# EAGLE design Enclosure 100x68 PBIA (EAGLE 9.6.1)
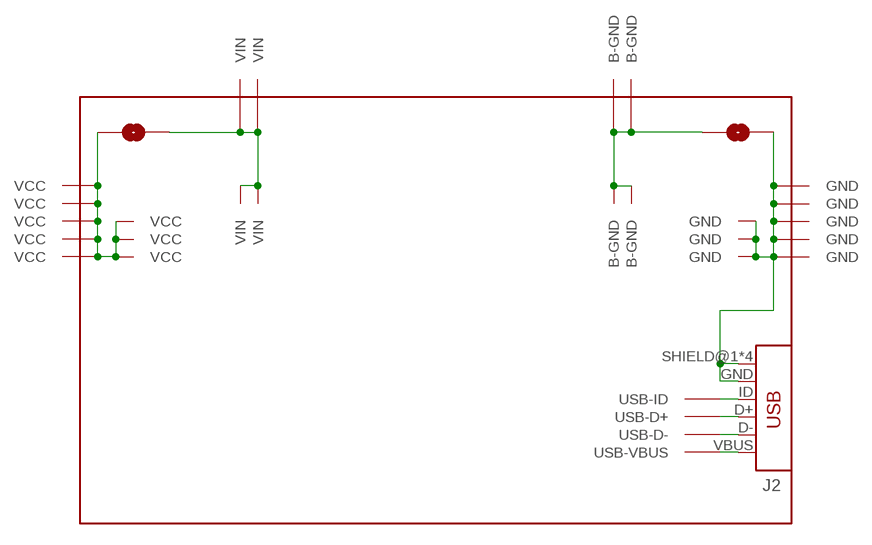
[diagram p0: schematic, sheet 1]

## Parts
J2  USB_MINI-B_SMT  [USB-MINIB]
P1  PROTO-34X22-BAT-PI-USB-SJ  [PROTO-34X22-BAT-PI-USB-SJ]

## Nets
GND: J2.GND J2.SHIELD@1(SHIELD) J2.SHIELD@2(SHIELD) J2.SHIELD@3(SHIELD) J2.SHIELD@4(SHIELD) P1.GND P1.P33-13(GND) P1.P33-14(GND) P1.P33-15(GND) P1.P34-13(GND) P1.P34-14(GND) P1.P34-15(GND) P1.P34-16(GND) P1.P34-17(GND)
N$2: P1.P02-17(VIN) P1.P03-16(VIN) P1.P05-19(VIN) P1.P06-19(VIN) P1.VIN
N$4: P1.B-GND P1.P28-19(B-GND) P1.P30-19(B-GND) P1.P32-16(B-GND) P1.P33-17(B-GND)
N$5: J2.ID P1.P31-09(USB-ID)
N$6: J2.D+ P1.P31-08(USB-D+)
N$7: J2.D- P1.P31-07(USB-D-)
N$8: J2.VBUS P1.P31-06(USB-VBUS)
VCC: P1.P01-13(VCC) P1.P01-14(VCC) P1.P01-15(VCC) P1.P01-16(VCC) P1.P01-17(VCC) P1.P02-13(VCC) P1.P02-14(VCC) P1.P02-15(VCC) P1.VCC

## Library data of the parts
J2 = digitalconcepts:USB_MINI-B: USB Mini-B Connector Breaks out 5 pins, and includes shield pins if needed.
P1 = digitalconcepts:PROTO-34X22-BAT-PI-USB-SJ: 34 x 22 Prototyping board, with battery connection (SJ isolation to GND + Vcc plane), Pi Zero stand off mounting holes and micro-USB connector to fit a 100 x 68 enclosure

## Board
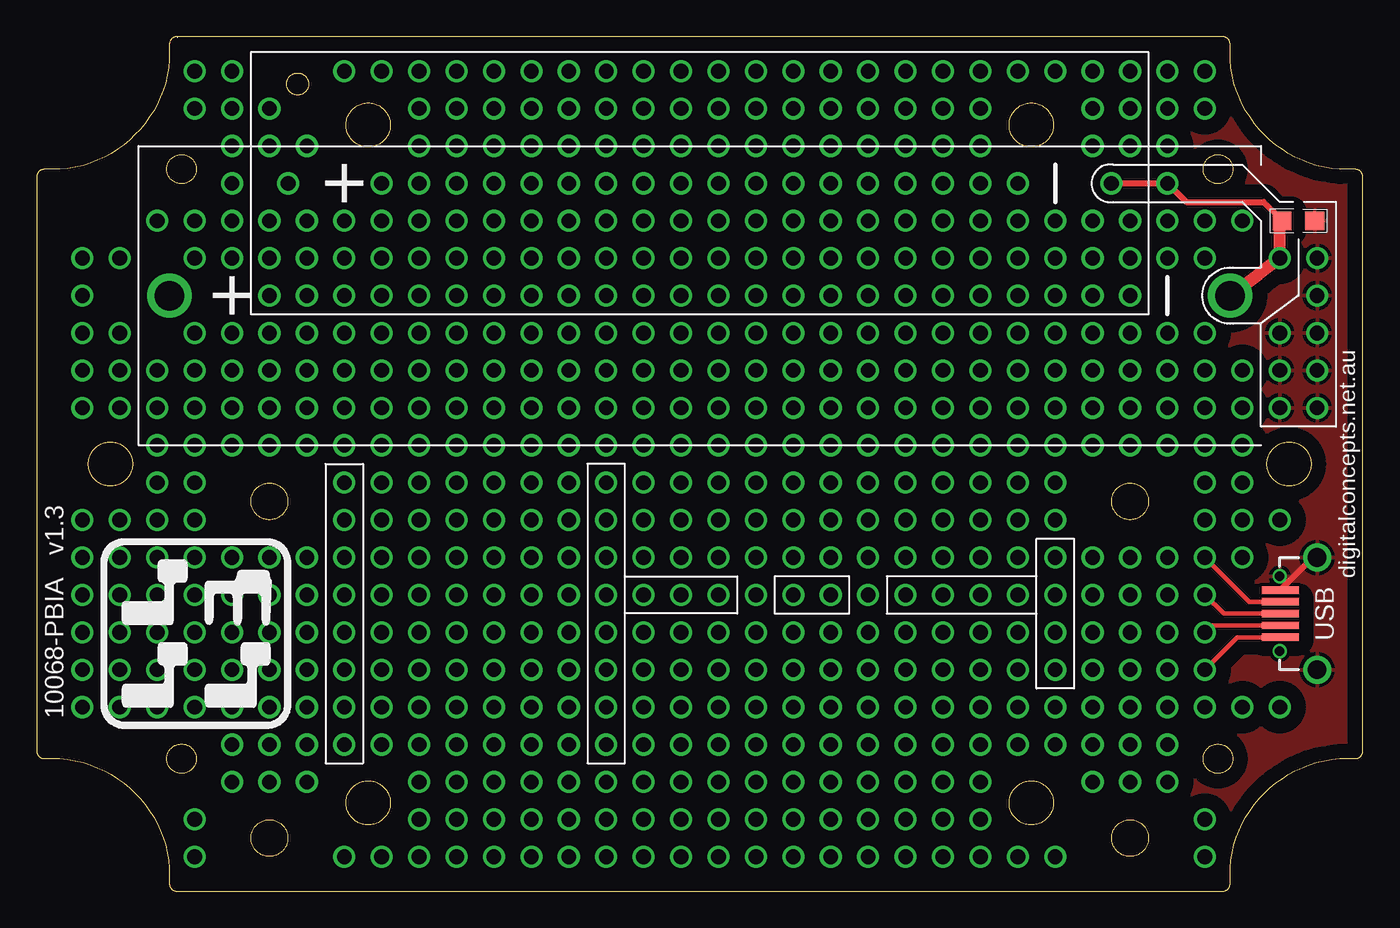
[diagram p1: board, top side]
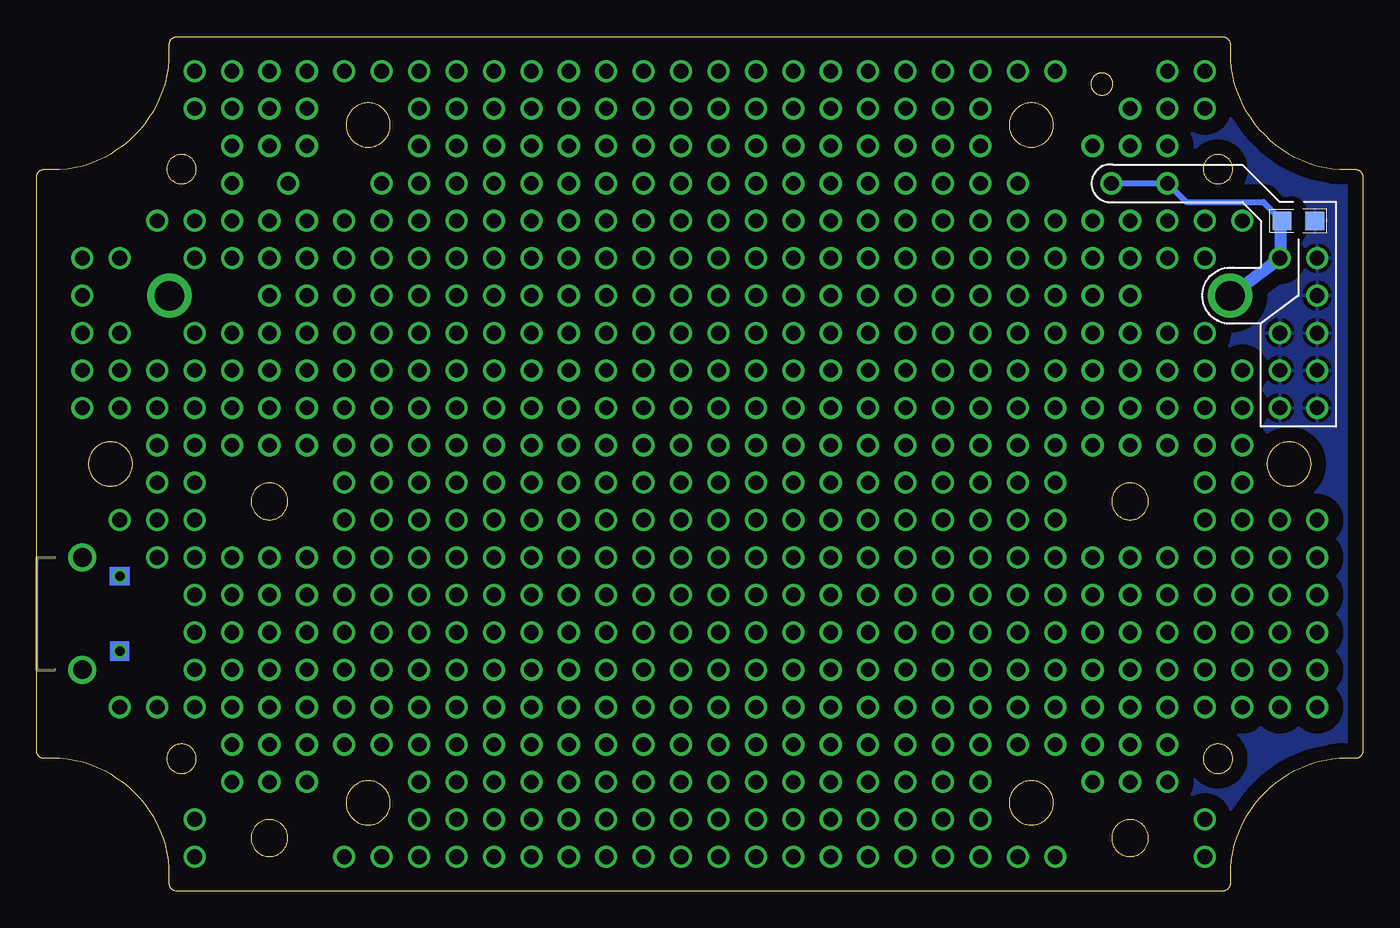
[diagram p2: board, bottom side, seen from below]

Size 90 x 58 mm. Coordinates in mm from the lower left corner, seen from the top.
Outline: 9.4,57.99 9.37,57.98 9.34,57.97 9.31,57.96 9.28,57.95 9.25,57.93 9.22,57.91 9.19,57.9 9.17,57.88 9.15,57.85 9.12,57.83 9.1,57.81 9.09,57.78 9.07,57.75 9.05,57.72 9.03,57.66 9.02,57.63 9.01,57.6 9,57.57 9,57.53 9,56.45 8.94,55.91 8.84,55.39 8.73,54.87 8.57,54.36 8.37,53.89 8.17,53.41 7.92,52.95 7.63,52.53 7.35,52.1 7.02,51.7 6.66,51.34 6.29,50.98 5.9,50.65 5.47,50.37 5.05,50.08 4.59,49.83 4.11,49.63 3.64,49.43 3.13,49.27 2.61,49.16 2.09,49.06 1.55,49 0.46,49 0.43,49 0.4,48.99 0.37,48.98 0.33,48.97 0.3,48.96 0.27,48.95 0.25,48.93 0.22,48.91 0.19,48.9 0.17,48.88 0.15,48.85 0.12,48.83 0.1,48.81 0.08,48.78 0.07,48.75 0.05,48.72 0.04,48.69 0.03,48.66 0.02,48.63 0.01,48.6 0,48.57 0,48.53 0,9.46 0,9.43 0.01,9.4 0.02,9.37 0.03,9.33 0.04,9.3 0.05,9.28 0.07,9.25 0.08,9.22 0.1,9.19 0.12,9.17 0.17,9.12 0.19,9.1 0.22,9.09 0.25,9.07 0.27,9.05 0.3,9.04 0.33,9.03 0.37,9.02 0.4,9.01 0.43,9 0.46,9 1.55,9 2.09,8.94 2.61,8.84 3.13,8.73 3.64,8.57 4.11,8.37 4.59,8.17 5.05,7.92 5.47,7.63 5.9,7.35 6.29,7.02 6.66,6.66 7.02,6.29 7.35,5.9 7.63,5.47 7.92,5.05 8.17,4.59 8.37,4.11 8.57,3.64 8.73,3.13 8.84,2.61 8.94,2.09 9,1.55 9,0.46 9,0.43 9.01,0.4 9.02,0.37 9.03,0.33 9.04,0.31 9.05,0.28 9.07,0.25 9.09,0.22 9.1,0.19 9.12,0.17 9.15,0.15 9.17,0.12 9.19,0.1 9.25,0.07 9.28,0.05 9.31,0.04 9.34,0.03 9.37,0.02 9.4,0.01 9.43,0 9.47,0 80.53,0 80.57,0 80.63,0.02 80.66,0.03 80.69,0.04 80.72,0.05 80.75,0.07 80.78,0.08 80.81,0.1 80.83,0.12 80.85,0.15 80.88,0.17 80.9,0.19 80.91,0.22 80.93,0.25 80.95,0.28 80.96,0.31 80.97,0.33 80.98,0.37 80.99,0.4 81,0.43 81,0.47 81,1.55 81.06,2.09 81.16,2.61 81.27,3.13 81.43,3.64 81.63,4.11 81.83,4.59 82.08,5.05 82.37,5.47 82.65,5.9 82.98,6.3 83.34,6.66 83.7,7.02 84.1,7.35 84.53,7.63 84.95,7.92 85.41,8.17 85.89,8.37 86.36,8.57 86.87,8.73 87.39,8.84 87.91,8.94 88.45,9 89.53,9 89.57,9 89.6,9.01 89.63,9.02 89.66,9.03 89.69,9.04 89.72,9.05 89.75,9.07 89.78,9.09 89.81,9.1 89.83,9.12 89.85,9.15 89.88,9.17 89.9,9.19 89.91,9.22 89.93,9.25 89.95,9.28 89.96,9.31 89.97,9.34 89.98,9.37 89.99,9.4 90,9.43 90,9.47 90,48.53 90,48.57 89.99,48.6 89.98,48.63 89.97,48.66 89.96,48.69 89.95,48.72 89.93,48.75 89.91,48.78 89.9,48.81 89.88,48.83 89.85,48.85 89.83,48.88 89.81,48.9 89.78,48.91 89.75,48.93 89.72,48.95 89.69,48.96 89.66,48.97 89.63,48.98 89.6,48.99 89.57,49 89.53,49 88.45,49 87.91,49.06 87.39,49.16 86.87,49.27 86.36,49.43 85.89,49.63 85.41,49.83 84.95,50.08 84.53,50.37 84.1,50.65 83.7,50.98 82.98,51.7 82.65,52.1 82.37,52.53 82.08,52.95 81.83,53.41 81.63,53.89 81.43,54.36 81.27,54.87 81.16,55.39 81.06,55.91 81,56.45 81,57.53 81,57.57 80.99,57.6 80.98,57.63 80.97,57.66 80.96,57.69 80.95,57.72 80.93,57.75 80.91,57.78 80.9,57.81 80.88,57.83 80.85,57.85 80.83,57.88 80.81,57.9 80.78,57.91 80.75,57.93 80.72,57.95 80.69,57.96 80.66,57.97 80.63,57.98 80.6,57.99 80.57,58 80.53,58 9.47,58 9.43,58 9.4,57.99
Outline: 15.54,2.37 15.46,2.39 15.38,2.42 15.3,2.45 15.23,2.48 15.16,2.52 15.09,2.56 15.02,2.61 14.96,2.66 14.91,2.72 14.85,2.77 14.8,2.83 14.75,2.9 14.71,2.97 14.67,3.04 14.64,3.11 14.61,3.19 14.58,3.27 14.56,3.35 14.55,3.43 14.54,3.51 14.54,3.69 14.55,3.77 14.56,3.85 14.58,3.93 14.61,4.01 14.64,4.09 14.67,4.16 14.71,4.23 14.75,4.3 14.8,4.36 14.85,4.43 14.91,4.48 14.96,4.54 15.02,4.59 15.09,4.64 15.16,4.68 15.23,4.72 15.3,4.75 15.38,4.78 15.46,4.81 15.54,4.82 15.62,4.84 15.7,4.85 15.88,4.85 15.96,4.84 16.04,4.82 16.12,4.81 16.2,4.78 16.28,4.75 16.35,4.72 16.42,4.68 16.49,4.64 16.55,4.59 16.62,4.54 16.67,4.48 16.73,4.43 16.78,4.36 16.83,4.3 16.87,4.23 16.91,4.16 16.94,4.09 16.97,4.01 17,3.93 17.01,3.85 17.03,3.77 17.04,3.69 17.04,3.51 17.03,3.43 17.01,3.35 17,3.27 16.97,3.19 16.94,3.11 16.91,3.04 16.87,2.97 16.83,2.9 16.78,2.83 16.73,2.77 16.67,2.72 16.62,2.66 16.55,2.61 16.49,2.56 16.42,2.52 16.35,2.48 16.28,2.45 16.2,2.42 16.12,2.39 16.04,2.37 15.96,2.36 15.88,2.35 15.7,2.35 15.62,2.36 15.54,2.37
Outline: 74.46,4.82 74.54,4.81 74.62,4.78 74.7,4.75 74.77,4.72 74.84,4.68 74.91,4.64 74.97,4.59 75.04,4.54 75.15,4.43 75.2,4.36 75.25,4.3 75.29,4.23 75.33,4.16 75.36,4.09 75.39,4.01 75.42,3.93 75.43,3.85 75.45,3.77 75.46,3.69 75.46,3.51 75.45,3.43 75.43,3.35 75.42,3.27 75.39,3.19 75.36,3.11 75.33,3.04 75.29,2.97 75.2,2.83 75.15,2.77 75.09,2.72 75.04,2.66 74.97,2.61 74.91,2.56 74.84,2.52 74.77,2.48 74.7,2.45 74.62,2.42 74.54,2.39 74.46,2.37 74.38,2.36 74.3,2.35 74.12,2.35 74.04,2.36 73.96,2.37 73.88,2.39 73.8,2.42 73.72,2.45 73.65,2.48 73.58,2.52 73.51,2.56 73.44,2.61 73.38,2.66 73.33,2.72 73.27,2.77 73.22,2.83 73.13,2.97 73.09,3.04 73.06,3.11 73.03,3.19 73,3.27 72.98,3.35 72.97,3.43 72.96,3.51 72.96,3.69 72.97,3.77 72.98,3.85 73,3.93 73.03,4.01 73.06,4.09 73.09,4.16 73.13,4.23 73.17,4.3 73.22,4.36 73.27,4.43 73.38,4.54 73.44,4.59 73.51,4.64 73.58,4.68 73.65,4.72 73.72,4.75 73.8,4.78 73.88,4.81 73.96,4.82 74.04,4.84 74.12,4.85 74.3,4.85 74.38,4.84 74.46,4.82
Outline: 67.81,7.46 67.9,7.44 68,7.41 68.09,7.37 68.18,7.33 68.26,7.28 68.34,7.23 68.42,7.18 68.5,7.12 68.56,7.05 68.63,6.98 68.69,6.91 68.75,6.83 68.8,6.75 68.85,6.66 68.89,6.57 68.92,6.48 68.95,6.39 68.97,6.29 68.99,6.19 69,6.09 69,5.88 68.99,5.78 68.97,5.69 68.95,5.59 68.92,5.49 68.89,5.4 68.85,5.31 68.8,5.23 68.75,5.15 68.69,5.07 68.63,4.99 68.56,4.93 68.5,4.86 68.42,4.8 68.34,4.74 68.26,4.69 68.18,4.64 68.09,4.61 68,4.57 67.9,4.54 67.81,4.52 67.71,4.5 67.61,4.49 67.4,4.49 67.3,4.5 67.2,4.52 67.1,4.54 67.01,4.57 66.92,4.61 66.83,4.64 66.74,4.69 66.59,4.8 66.51,4.86 66.44,4.93 66.37,4.99 66.31,5.07 66.26,5.15 66.21,5.23 66.16,5.31 66.12,5.4 66.08,5.49 66.05,5.59 66.03,5.69 66.01,5.78 66,5.88 66,6.09 66.01,6.19 66.05,6.39 66.08,6.48 66.12,6.57 66.16,6.66 66.21,6.75 66.26,6.83 66.31,6.91 66.37,6.98 66.44,7.05 66.51,7.12 66.59,7.18 66.67,7.23 66.74,7.28 66.83,7.33 66.92,7.37 67.01,7.41 67.1,7.44 67.2,7.46 67.3,7.48 67.4,7.49 67.61,7.49 67.71,7.48 67.81,7.46
Outline: 22.8,7.46 22.89,7.44 22.99,7.41 23.08,7.37 23.17,7.33 23.25,7.28 23.33,7.23 23.41,7.18 23.49,7.12 23.56,7.05 23.62,6.98 23.68,6.91 23.74,6.83 23.79,6.75 23.84,6.66 23.88,6.57 23.92,6.48 23.94,6.39 23.96,6.29 23.98,6.19 24,6.09 24,5.88 23.98,5.78 23.96,5.69 23.94,5.59 23.92,5.49 23.88,5.4 23.84,5.31 23.79,5.23 23.74,5.15 23.68,5.07 23.62,4.99 23.56,4.93 23.49,4.86 23.41,4.8 23.25,4.69 23.17,4.64 23.08,4.61 22.99,4.57 22.89,4.54 22.8,4.52 22.7,4.5 22.6,4.49 22.39,4.49 22.29,4.5 22.19,4.52 22.1,4.54 22,4.57 21.91,4.61 21.82,4.64 21.74,4.69 21.66,4.74 21.58,4.8 21.5,4.86 21.43,4.93 21.37,4.99 21.3,5.07 21.25,5.15 21.2,5.23 21.15,5.31 21.11,5.4 21.07,5.49 21.05,5.59 21.02,5.69 21.01,5.78 20.99,5.88 20.99,6.09 21.01,6.19 21.02,6.29 21.05,6.39 21.07,6.48 21.11,6.57 21.15,6.66 21.2,6.75 21.25,6.83 21.3,6.91 21.37,6.98 21.43,7.05 21.5,7.12 21.58,7.18 21.66,7.23 21.74,7.28 21.82,7.33 21.91,7.37 22,7.41 22.1,7.44 22.19,7.46 22.29,7.48 22.39,7.49 22.6,7.49 22.7,7.48 22.8,7.46
Outline: 80.38,9.96 80.44,9.95 80.51,9.93 80.57,9.91 80.63,9.88 80.68,9.85 80.74,9.81 80.79,9.78 80.84,9.74 80.89,9.69 80.93,9.65 80.97,9.6 81.01,9.54 81.04,9.49 81.07,9.43 81.1,9.37 81.13,9.31 81.14,9.25 81.16,9.19 81.17,9.12 81.18,9.05 81.18,8.92 81.17,8.85 81.16,8.78 81.14,8.72 81.13,8.66 81.1,8.6 81.07,8.54 81.04,8.48 81.01,8.43 80.97,8.37 80.93,8.32 80.89,8.28 80.84,8.23 80.79,8.19 80.74,8.16 80.68,8.12 80.63,8.09 80.57,8.06 80.51,8.04 80.44,8.02 80.38,8 80.31,7.99 80.25,7.98 80.11,7.98 80.04,7.99 79.98,8 79.91,8.02 79.85,8.04 79.79,8.06 79.73,8.09 79.67,8.12 79.62,8.16 79.57,8.19 79.52,8.23 79.47,8.28 79.43,8.32 79.38,8.37 79.35,8.43 79.31,8.48 79.28,8.54 79.26,8.6 79.23,8.66 79.21,8.72 79.2,8.78 79.19,8.85 79.18,8.92 79.18,9.05 79.19,9.12 79.2,9.19 79.21,9.25 79.23,9.31 79.26,9.37 79.28,9.43 79.31,9.49 79.35,9.54 79.38,9.6 79.43,9.65 79.47,9.69 79.52,9.74 79.57,9.78 79.62,9.81 79.67,9.85 79.73,9.88 79.79,9.91 79.85,9.93 79.91,9.95 79.98,9.96 80.04,9.98 80.11,9.98 80.25,9.98 80.31,9.98 80.38,9.96
Outline: 10.02,9.96 10.09,9.95 10.15,9.93 10.21,9.91 10.27,9.88 10.33,9.85 10.38,9.81 10.43,9.78 10.48,9.74 10.53,9.69 10.57,9.65 10.61,9.6 10.65,9.54 10.69,9.49 10.72,9.43 10.74,9.37 10.77,9.31 10.79,9.25 10.8,9.19 10.81,9.12 10.82,9.05 10.82,8.92 10.81,8.85 10.8,8.78 10.79,8.72 10.77,8.66 10.74,8.6 10.72,8.54 10.69,8.48 10.65,8.43 10.61,8.37 10.57,8.32 10.53,8.28 10.48,8.23 10.43,8.19 10.38,8.16 10.33,8.12 10.27,8.09 10.21,8.06 10.15,8.04 10.09,8.02 10.02,8 9.96,7.99 9.89,7.98 9.75,7.98 9.68,7.99 9.62,8 9.55,8.02 9.49,8.04 9.43,8.06 9.37,8.09 9.31,8.12 9.26,8.16 9.21,8.19 9.16,8.23 9.11,8.28 9.07,8.32 9.03,8.37 8.99,8.43 8.96,8.48 8.92,8.54 8.9,8.6 8.87,8.66 8.85,8.72 8.84,8.78 8.83,8.85 8.82,8.92 8.82,9.05 8.83,9.12 8.84,9.19 8.85,9.25 8.87,9.31 8.9,9.37 8.92,9.43 8.96,9.49 8.99,9.54 9.03,9.6 9.07,9.65 9.11,9.69 9.16,9.74 9.21,9.78 9.26,9.81 9.31,9.85 9.37,9.88 9.43,9.91 9.49,9.93 9.55,9.95 9.62,9.96 9.68,9.98 9.75,9.98 9.89,9.98 9.96,9.98 10.02,9.96
Outline: 15.54,25.23 15.46,25.25 15.38,25.28 15.3,25.31 15.23,25.34 15.16,25.38 15.09,25.42 15.02,25.47 14.96,25.52 14.91,25.58 14.85,25.63 14.8,25.69 14.75,25.76 14.71,25.83 14.67,25.9 14.61,26.05 14.58,26.13 14.56,26.21 14.55,26.29 14.54,26.37 14.54,26.55 14.55,26.63 14.56,26.71 14.58,26.79 14.61,26.87 14.64,26.95 14.67,27.02 14.71,27.09 14.75,27.16 14.8,27.22 14.85,27.29 14.96,27.4 15.02,27.45 15.09,27.5 15.16,27.54 15.23,27.58 15.3,27.61 15.38,27.64 15.46,27.67 15.54,27.68 15.62,27.7 15.7,27.71 15.88,27.71 15.96,27.7 16.04,27.68 16.12,27.67 16.2,27.64 16.28,27.61 16.35,27.58 16.42,27.54 16.49,27.5 16.55,27.45 16.62,27.4 16.73,27.29 16.78,27.22 16.83,27.16 16.87,27.09 16.91,27.02 16.94,26.95 16.97,26.87 17,26.79 17.01,26.71 17.03,26.63 17.04,26.55 17.04,26.37 17.03,26.29 17.01,26.21 17,26.13 16.97,26.05 16.94,25.97 16.91,25.9 16.87,25.83 16.83,25.76 16.78,25.69 16.73,25.63 16.67,25.58 16.62,25.52 16.55,25.47 16.49,25.42 16.42,25.38 16.35,25.34 16.28,25.31 16.2,25.28 16.12,25.25 16.04,25.23 15.96,25.22 15.88,25.21 15.7,25.21 15.62,25.22 15.54,25.23
Outline: 75.15,27.29 75.2,27.22 75.25,27.16 75.29,27.09 75.33,27.02 75.36,26.95 75.39,26.87 75.42,26.79 75.43,26.71 75.45,26.63 75.46,26.55 75.46,26.37 75.45,26.29 75.43,26.21 75.42,26.13 75.39,26.05 75.36,25.97 75.33,25.9 75.29,25.83 75.2,25.69 75.15,25.63 75.09,25.58 75.04,25.52 74.97,25.47 74.91,25.42 74.84,25.38 74.77,25.34 74.7,25.31 74.62,25.28 74.54,25.25 74.46,25.23 74.38,25.22 74.3,25.21 74.12,25.21 74.04,25.22 73.96,25.23 73.88,25.25 73.8,25.28 73.72,25.31 73.65,25.34 73.58,25.38 73.51,25.42 73.44,25.47 73.38,25.52 73.33,25.58 73.27,25.63 73.22,25.69 73.13,25.83 73.09,25.9 73.06,25.97 73.03,26.05 73,26.13 72.98,26.21 72.97,26.29 72.96,26.37 72.96,26.55 72.97,26.63 72.98,26.71 73,26.79 73.03,26.87 73.06,26.95 73.09,27.02 73.13,27.09 73.17,27.16 73.22,27.22 73.27,27.29 73.38,27.4 73.44,27.45 73.51,27.5 73.58,27.54 73.65,27.58 73.72,27.61 73.8,27.64 73.88,27.67 73.96,27.68 74.04,27.7 74.12,27.71 74.3,27.71 74.38,27.7 74.46,27.68 74.54,27.67 74.62,27.64 74.7,27.61 74.77,27.58 74.84,27.54 74.91,27.5 74.97,27.45 75.04,27.4 75.15,27.29
Outline: 85.31,30.47 85.4,30.45 85.5,30.42 85.59,30.38 85.68,30.34 85.76,30.3 85.84,30.24 85.92,30.19 86,30.13 86.06,30.06 86.13,29.99 86.19,29.92 86.25,29.84 86.3,29.76 86.35,29.67 86.39,29.58 86.42,29.49 86.45,29.4 86.47,29.3 86.49,29.2 86.5,29.1 86.5,28.9 86.49,28.8 86.47,28.7 86.45,28.6 86.42,28.51 86.39,28.42 86.35,28.33 86.3,28.24 86.25,28.16 86.19,28.08 86.13,28.01 86.06,27.94 86,27.87 85.92,27.81 85.84,27.76 85.76,27.7 85.68,27.66 85.59,27.62 85.5,27.58 85.4,27.55 85.31,27.53 85.21,27.51 85.11,27.5 84.9,27.5 84.8,27.51 84.7,27.53 84.6,27.55 84.51,27.58 84.42,27.62 84.33,27.66 84.25,27.7 84.17,27.76 84.09,27.81 84.01,27.87 83.94,27.94 83.88,28.01 83.81,28.08 83.76,28.16 83.71,28.24 83.66,28.33 83.62,28.42 83.58,28.51 83.55,28.6 83.54,28.7 83.52,28.8 83.5,28.9 83.5,29.1 83.52,29.2 83.54,29.3 83.55,29.4 83.58,29.49 83.62,29.58 83.66,29.67 83.71,29.76 83.76,29.84 83.81,29.92 83.88,29.99 83.94,30.06 84.01,30.13 84.09,30.19 84.17,30.24 84.25,30.3 84.33,30.34 84.42,30.38 84.51,30.42 84.6,30.45 84.7,30.47 84.8,30.49 84.9,30.5 85.11,30.5 85.21,30.49 85.31,30.47
Outline: 5.3,30.47 5.39,30.45 5.49,30.42 5.67,30.34 5.75,30.3 5.83,30.24 5.91,30.19 5.99,30.13 6.06,30.06 6.12,29.99 6.18,29.92 6.24,29.84 6.29,29.76 6.34,29.67 6.41,29.49 6.44,29.4 6.46,29.3 6.48,29.2 6.49,29.1 6.49,28.9 6.48,28.8 6.46,28.7 6.44,28.6 6.41,28.51 6.38,28.42 6.34,28.33 6.29,28.24 6.24,28.16 6.18,28.08 6.12,28.01 6.06,27.94 5.99,27.87 5.91,27.81 5.83,27.76 5.75,27.7 5.67,27.66 5.58,27.62 5.49,27.58 5.39,27.55 5.3,27.53 5.2,27.51 5.1,27.5 4.89,27.5 4.79,27.51 4.69,27.53 4.59,27.55 4.5,27.58 4.41,27.62 4.32,27.66 4.24,27.7 4.16,27.76 4.08,27.81 4,27.87 3.93,27.94 3.87,28.01 3.8,28.08 3.75,28.16 3.7,28.24 3.65,28.33 3.61,28.42 3.57,28.51 3.54,28.6 3.52,28.7 3.5,28.8 3.49,28.9 3.49,29.1 3.5,29.2 3.52,29.3 3.54,29.4 3.57,29.49 3.61,29.58 3.65,29.67 3.7,29.76 3.75,29.84 3.8,29.92 3.87,29.99 3.93,30.06 4,30.13 4.08,30.19 4.16,30.24 4.24,30.3 4.32,30.34 4.5,30.42 4.59,30.45 4.69,30.47 4.79,30.49 4.89,30.5 5.1,30.5 5.2,30.49 5.3,30.47
Outline: 80.38,49.99 80.44,49.98 80.51,49.96 80.57,49.94 80.63,49.91 80.68,49.88 80.74,49.84 80.79,49.81 80.84,49.77 80.93,49.68 80.97,49.63 81.01,49.57 81.04,49.52 81.07,49.46 81.1,49.4 81.13,49.34 81.14,49.28 81.16,49.22 81.17,49.15 81.18,49.08 81.18,48.95 81.17,48.88 81.16,48.81 81.14,48.75 81.13,48.69 81.1,48.63 81.07,48.57 81.04,48.51 81.01,48.46 80.97,48.4 80.93,48.35 80.84,48.26 80.79,48.22 80.74,48.19 80.68,48.15 80.63,48.12 80.57,48.09 80.51,48.07 80.44,48.05 80.38,48.03 80.31,48.02 80.25,48.01 80.11,48.01 80.04,48.02 79.98,48.03 79.91,48.05 79.85,48.07 79.79,48.09 79.73,48.12 79.67,48.15 79.62,48.19 79.57,48.22 79.52,48.26 79.43,48.35 79.38,48.4 79.35,48.46 79.31,48.51 79.28,48.57 79.26,48.63 79.23,48.69 79.21,48.75 79.2,48.81 79.19,48.88 79.18,48.95 79.18,49.08 79.19,49.15 79.2,49.22 79.21,49.28 79.23,49.34 79.26,49.4 79.28,49.46 79.31,49.52 79.35,49.57 79.38,49.63 79.43,49.68 79.52,49.77 79.57,49.81 79.62,49.84 79.67,49.88 79.73,49.91 79.79,49.94 79.85,49.96 79.91,49.98 79.98,49.99 80.04,50.01 80.11,50.01 80.25,50.01 80.31,50.01 80.38,49.99
Outline: 10.02,49.99 10.09,49.98 10.15,49.96 10.21,49.94 10.27,49.91 10.33,49.88 10.38,49.84 10.43,49.81 10.48,49.77 10.53,49.72 10.57,49.68 10.61,49.63 10.65,49.57 10.69,49.52 10.72,49.46 10.74,49.4 10.77,49.34 10.79,49.28 10.8,49.22 10.81,49.15 10.82,49.08 10.82,48.95 10.81,48.88 10.8,48.81 10.79,48.75 10.77,48.69 10.74,48.63 10.72,48.57 10.69,48.51 10.65,48.46 10.61,48.4 10.57,48.35 10.53,48.31 10.48,48.26 10.43,48.22 10.38,48.19 10.33,48.15 10.27,48.12 10.21,48.09 10.15,48.07 10.09,48.05 10.02,48.03 9.96,48.02 9.89,48.01 9.75,48.01 9.68,48.02 9.62,48.03 9.55,48.05 9.49,48.07 9.43,48.09 9.37,48.12 9.31,48.15 9.26,48.19 9.21,48.22 9.16,48.26 9.11,48.31 9.07,48.35 9.03,48.4 8.99,48.46 8.96,48.51 8.92,48.57 8.9,48.63 8.87,48.69 8.85,48.75 8.84,48.81 8.83,48.88 8.82,48.95 8.82,49.08 8.83,49.15 8.84,49.22 8.85,49.28 8.87,49.34 8.9,49.4 8.92,49.46 8.96,49.52 8.99,49.57 9.03,49.63 9.07,49.68 9.11,49.72 9.16,49.77 9.21,49.81 9.26,49.84 9.31,49.88 9.37,49.91 9.43,49.94 9.49,49.96 9.55,49.98 9.62,49.99 9.68,50.01 9.75,50.01 9.89,50.01 9.96,50.01 10.02,49.99
Outline: 22.19,50.54 22.1,50.56 22,50.59 21.91,50.63 21.82,50.67 21.74,50.71 21.66,50.77 21.58,50.82 21.5,50.88 21.43,50.95 21.37,51.02 21.31,51.09 21.25,51.17 21.2,51.25 21.15,51.34 21.11,51.43 21.07,51.52 21.05,51.61 21.03,51.71 21.01,51.81 21,51.91 21,52.12 21.01,52.22 21.03,52.31 21.05,52.41 21.07,52.51 21.11,52.6 21.15,52.69 21.2,52.77 21.25,52.85 21.31,52.93 21.37,53.01 21.43,53.07 21.5,53.14 21.58,53.2 21.66,53.26 21.74,53.31 21.82,53.36 21.91,53.39 22,53.43 22.1,53.46 22.19,53.48 22.29,53.5 22.39,53.51 22.6,53.51 22.7,53.5 22.8,53.48 22.89,53.46 22.99,53.43 23.08,53.39 23.17,53.36 23.25,53.31 23.33,53.26 23.41,53.2 23.49,53.14 23.56,53.07 23.62,53.01 23.68,52.93 23.74,52.85 23.79,52.77 23.84,52.69 23.88,52.6 23.91,52.51 23.94,52.41 23.96,52.31 23.98,52.22 24,52.12 24,51.91 23.98,51.81 23.96,51.71 23.94,51.61 23.91,51.52 23.88,51.43 23.84,51.34 23.79,51.25 23.74,51.17 23.68,51.09 23.62,51.02 23.56,50.95 23.49,50.88 23.41,50.82 23.33,50.77 23.25,50.71 23.17,50.67 23.08,50.63 22.99,50.59 22.89,50.56 22.8,50.54 22.7,50.52 22.6,50.51 22.39,50.51 22.29,50.52 22.19,50.54
Outline: 67.81,53.48 67.9,53.46 68,53.43 68.09,53.39 68.18,53.36 68.26,53.31 68.34,53.26 68.42,53.2 68.5,53.14 68.63,53.01 68.69,52.93 68.75,52.85 68.8,52.77 68.85,52.69 68.89,52.6 68.92,52.51 68.95,52.41 68.97,52.31 68.99,52.22 69,52.12 69,51.91 68.99,51.81 68.97,51.71 68.95,51.61 68.92,51.52 68.89,51.43 68.85,51.34 68.8,51.25 68.75,51.17 68.69,51.09 68.63,51.02 68.5,50.88 68.42,50.82 68.34,50.77 68.26,50.71 68.18,50.67 68.09,50.63 68,50.59 67.9,50.56 67.81,50.54 67.71,50.52 67.61,50.51 67.4,50.51 67.3,50.52 67.2,50.54 67.1,50.56 67.01,50.59 66.92,50.63 66.83,50.67 66.75,50.71 66.67,50.77 66.59,50.82 66.51,50.88 66.44,50.95 66.37,51.02 66.31,51.09 66.26,51.17 66.21,51.25 66.16,51.34 66.12,51.43 66.08,51.52 66.05,51.61 66.03,51.71 66.01,51.81 66,51.91 66,52.12 66.01,52.22 66.03,52.31 66.05,52.41 66.08,52.51 66.12,52.6 66.16,52.69 66.21,52.77 66.26,52.85 66.31,52.93 66.37,53.01 66.44,53.07 66.51,53.14 66.59,53.2 66.67,53.26 66.75,53.31 66.83,53.36 66.92,53.39 67.01,53.43 67.1,53.46 67.2,53.48 67.3,53.5 67.4,53.51 67.61,53.51 67.71,53.5 67.81,53.48
Outline: 17.85,55.53 17.9,55.52 17.95,55.5 17.99,55.48 18.04,55.46 18.08,55.44 18.12,55.41 18.16,55.39 18.2,55.36 18.23,55.32 18.27,55.29 18.3,55.25 18.32,55.21 18.35,55.17 18.37,55.13 18.39,55.08 18.41,55.04 18.43,54.99 18.44,54.94 18.45,54.89 18.45,54.84 18.45,54.74 18.45,54.69 18.44,54.64 18.43,54.59 18.41,54.55 18.39,54.5 18.37,54.46 18.35,54.41 18.32,54.37 18.3,54.33 18.27,54.3 18.23,54.26 18.2,54.23 18.16,54.2 18.12,54.17 18.08,54.14 18.04,54.12 17.99,54.1 17.95,54.08 17.9,54.07 17.85,54.06 17.8,54.05 17.75,54.04 17.65,54.04 17.6,54.05 17.55,54.06 17.5,54.07 17.45,54.08 17.41,54.1 17.37,54.12 17.32,54.14 17.28,54.17 17.24,54.2 17.21,54.23 17.17,54.26 17.14,54.3 17.11,54.33 17.08,54.37 17.05,54.41 17.03,54.46 17.01,54.5 16.99,54.55 16.98,54.59 16.97,54.64 16.96,54.69 16.95,54.74 16.95,54.84 16.96,54.89 16.97,54.94 16.98,54.99 16.99,55.04 17.01,55.08 17.03,55.13 17.05,55.17 17.08,55.21 17.11,55.25 17.14,55.29 17.17,55.32 17.21,55.36 17.24,55.39 17.28,55.41 17.32,55.44 17.37,55.46 17.41,55.48 17.45,55.5 17.5,55.52 17.55,55.53 17.6,55.54 17.65,55.54 17.75,55.54 17.8,55.54 17.85,55.53
Copper layers (1*16): Top 0.035mm / dielectric 1.5mm / Bottom 0.035mm
Design rules "default *": minimum track width 6mil, minimum drill 0.35mm, track to track 6mil, track to pad 6mil, pad to pad 6mil, via to via 6mil, smd to smd 6mil, copper to edge 40mil, drill to drill 6mil, minimum pad ring 0mil, minimum via ring 8mil, stop-mask expansion 4mil, vias tented up to drill 0mil, thermal gap 10mil

### Footprints (pad centres in the part's own frame; a part is rotated, then mirrored left to right if it is on the bottom)
USB-MINIB = smd 2.5 x 0.5: D+ 2.5,0; D- 2.5,0.8; GND 2.5,-1.6; ID 2.5,-0.8; VBUS 2.5,1.6 | drill 1.27: SHIELD@1 0,3.81; SHIELD@2 0,-3.81 | drill 0.65 pad 0.762: SHIELD@3 2.54,2.54; SHIELD@4 2.54,-2.54
PROTO-34X22-BAT-PI-USB-SJ = smd 1.27 x 1.27: B-GND 39.534,16.51; GND 41.746,16.51 | drill 1: P01-05 -41.91,-16.51; P01-06 -41.91,-13.97; P01-07 -41.91,-11.43; P01-08 -41.91,-8.89; P01-09 -41.91,-6.35; P01-10 -41.91,-3.81; P01-13 -41.91,3.81; P01-14 -41.91,6.35; P01-15 -41.91,8.89; P01-16 -41.91,11.43; P01-17 -41.91,13.97; P02-05 -39.37,-16.51; P02-06 -39.37,-13.97; P02-07 -39.37,-11.43; P02-08 -39.37,-8.89; P02-09 -39.37,-6.35; P02-10 -39.37,-3.81; P02-13 -39.37,3.81; P02-14 -39.37,6.35; P02-15 -39.37,8.89; P02-17 -39.37,13.97; P03-05 -36.83,-16.51; P03-06 -36.83,-13.97; P03-07 -36.83,-11.43; P03-08 -36.83,-8.89; P03-09 -36.83,-6.35; P03-10 -36.83,-3.81; P03-11 -36.83,-1.27; P03-12 -36.83,1.27; P03-13 -36.83,3.81; P03-14 -36.83,6.35; P03-18 -36.83,16.51; P04-01 -34.29,-26.67; P04-02 -34.29,-24.13; P04-05 -34.29,-16.51; P04-06 -34.29,-13.97; P04-07 -34.29,-11.43; P04-08 -34.29,-8.89; P04-09 -34.29,-6.35; P04-10 -34.29,-3.81; P04-11 -34.29,-1.27; P04-12 -34.29,1.27; P04-13 -34.29,3.81; P04-14 -34.29,6.35; P04-15 -34.29,8.89; P04-17 -34.29,13.97; P04-18 -34.29,16.51; P04-21 -34.29,24.13; P04-22 -34.29,26.67; P05-03 -31.75,-21.59; P05-04 -31.75,-19.05; P05-05 -31.75,-16.51; P05-06 -31.75,-13.97; P05-07 -31.75,-11.43; P05-08 -31.75,-8.89; P05-09 -31.75,-6.35; P05-12 -31.75,1.27; P05-13 -31.75,3.81; P05-14 -31.75,6.35; P05-15 -31.75,8.89; P05-17 -31.75,13.97; P05-18 -31.75,16.51; P05-19 -31.75,19.05; P05-20 -31.75,21.59; P05-21 -31.75,24.13; P05-22 -31.75,26.67; P06-03 -29.21,-21.59; P06-04 -29.21,-19.05; P06-05 -29.21,-16.51; P06-06 -29.21,-13.97; P06-07 -29.21,-11.43; P06-08 -29.21,-8.89; P06-09 -29.21,-6.35; P06-12 -29.21,1.27; P06-13 -29.21,3.81; P06-14 -29.21,6.35; P06-15 -29.21,8.89; P06-16 -29.21,11.43; P06-17 -29.21,13.97; P06-18 -29.21,16.51; P06-19 -27.94,19.05; P06-20 -29.21,21.59; P06-21 -29.21,24.13; P07-03 -26.67,-21.59; P07-04 -26.67,-19.05; P07-05 -26.67,-16.51; P07-06 -26.67,-13.97; P07-07 -26.67,-11.43; P07-08 -26.67,-8.89; P07-09 -26.67,-6.35; P07-12 -26.67,1.27; P07-13 -26.67,3.81; P07-14 -26.67,6.35; P07-15 -26.67,8.89; P07-16 -26.67,11.43; P07-17 -26.67,13.97; P07-18 -26.67,16.51; P07-20 -26.67,21.59; P08-01 -24.13,-26.67; P08-04 -24.13,-19.05; P08-05 -24.13,-16.51; P08-06 -24.13,-13.97; P08-07 -24.13,-11.43; P08-08 -24.13,-8.89; P08-09 -24.13,-6.35; P08-10 -24.13,-3.81; P08-11 -24.13,-1.27; P08-12 -24.13,1.27; P08-13 -24.13,3.81; P08-14 -24.13,6.35; P08-15 -24.13,8.89; P08-16 -24.13,11.43; P08-17 -24.13,13.97; P08-18 -24.13,16.51; P08-22 -24.13,26.67; P09-01 -21.59,-26.67; P09-04 -21.59,-19.05; P09-05 -21.59,-16.51; P09-06 -21.59,-13.97; P09-07 -21.59,-11.43; P09-08 -21.59,-8.89; P09-09 -21.59,-6.35; P09-10 -21.59,-3.81; P09-11 -21.59,-1.27; P09-12 -21.59,1.27; P09-13 -21.59,3.81; P09-14 -21.59,6.35; P09-15 -21.59,8.89; P09-16 -21.59,11.43; P09-17 -21.59,13.97; P09-18 -21.59,16.51; P09-19 -21.59,19.05; P09-22 -21.59,26.67; P10-01 -19.05,-26.67; P10-02 -19.05,-24.13; P10-03 -19.05,-21.59; P10-04 -19.05,-19.05; P10-05 -19.05,-16.51; P10-06 -19.05,-13.97; P10-07 -19.05,-11.43; P10-08 -19.05,-8.89; P10-09 -19.05,-6.35; P10-10 -19.05,-3.81; P10-11 -19.05,-1.27; P10-12 -19.05,1.27; P10-13 -19.05,3.81; P10-14 -19.05,6.35; P10-15 -19.05,8.89; P10-16 -19.05,11.43; P10-17 -19.05,13.97; P10-18 -19.05,16.51; P10-19 -19.05,19.05; P10-20 -19.05,21.59; P10-21 -19.05,24.13; P10-22 -19.05,26.67; P11-01 -16.51,-26.67; P11-02 -16.51,-24.13; P11-03 -16.51,-21.59; P11-04 -16.51,-19.05; P11-05 -16.51,-16.51; P11-06 -16.51,-13.97; P11-07 -16.51,-11.43; P11-08 -16.51,-8.89; P11-09 -16.51,-6.35; P11-10 -16.51,-3.81; P11-11 -16.51,-1.27; P11-12 -16.51,1.27; P11-13 -16.51,3.81; P11-14 -16.51,6.35; P11-15 -16.51,8.89; P11-16 -16.51,11.43; P11-17 -16.51,13.97; P11-18 -16.51,16.51; P11-19 -16.51,19.05; P11-20 -16.51,21.59; P11-21 -16.51,24.13; P11-22 -16.51,26.67; P12-01 -13.97,-26.67; P12-02 -13.97,-24.13; P12-03 -13.97,-21.59; P12-04 -13.97,-19.05; P12-05 -13.97,-16.51; P12-06 -13.97,-13.97; P12-07 -13.97,-11.43; P12-08 -13.97,-8.89; P12-09 -13.97,-6.35; P12-10 -13.97,-3.81; P12-11 -13.97,-1.27; P12-12 -13.97,1.27; P12-13 -13.97,3.81; P12-14 -13.97,6.35; P12-15 -13.97,8.89; P12-16 -13.97,11.43; P12-17 -13.97,13.97; P12-18 -13.97,16.51; P12-19 -13.97,19.05; P12-20 -13.97,21.59; P12-21 -13.97,24.13; P12-22 -13.97,26.67; P13-01 -11.43,-26.67; P13-02 -11.43,-24.13; P13-03 -11.43,-21.59; P13-04 -11.43,-19.05; P13-05 -11.43,-16.51; P13-06 -11.43,-13.97; P13-07 -11.43,-11.43; P13-08 -11.43,-8.89; P13-09 -11.43,-6.35; P13-10 -11.43,-3.81; P13-11 -11.43,-1.27; P13-12 -11.43,1.27; P13-13 -11.43,3.81; P13-14 -11.43,6.35; P13-15 -11.43,8.89; P13-16 -11.43,11.43; P13-17 -11.43,13.97; P13-18 -11.43,16.51; P13-19 -11.43,19.05; P13-20 -11.43,21.59; P13-21 -11.43,24.13; P13-22 -11.43,26.67; P14-01 -8.89,-26.67; P14-02 -8.89,-24.13; P14-03 -8.89,-21.59; P14-04 -8.89,-19.05; P14-05 -8.89,-16.51; P14-06 -8.89,-13.97; P14-07 -8.89,-11.43; P14-08 -8.89,-8.89; P14-09 -8.89,-6.35; P14-10 -8.89,-3.81; P14-11 -8.89,-1.27; P14-12 -8.89,1.27; P14-13 -8.89,3.81; P14-14 -8.89,6.35; P14-15 -8.89,8.89; P14-16 -8.89,11.43; P14-17 -8.89,13.97; P14-18 -8.89,16.51; P14-19 -8.89,19.05; P14-20 -8.89,21.59; P14-21 -8.89,24.13; P14-22 -8.89,26.67; P15-01 -6.35,-26.67; P15-02 -6.35,-24.13; P15-03 -6.35,-21.59; P15-04 -6.35,-19.05; P15-05 -6.35,-16.51; P15-06 -6.35,-13.97; P15-07 -6.35,-11.43; P15-08 -6.35,-8.89; P15-09 -6.35,-6.35; P15-10 -6.35,-3.81; P15-11 -6.35,-1.27; P15-12 -6.35,1.27; P15-13 -6.35,3.81; P15-14 -6.35,6.35; P15-15 -6.35,8.89; P15-16 -6.35,11.43; P15-17 -6.35,13.97; P15-18 -6.35,16.51; P15-19 -6.35,19.05; P15-20 -6.35,21.59; P15-21 -6.35,24.13; P15-22 -6.35,26.67; P16-01 -3.81,-26.67; P16-02 -3.81,-24.13; P16-03 -3.81,-21.59; P16-04 -3.81,-19.05; P16-05 -3.81,-16.51; P16-06 -3.81,-13.97; P16-07 -3.81,-11.43; P16-08 -3.81,-8.89; P16-09 -3.81,-6.35; P16-10 -3.81,-3.81; P16-11 -3.81,-1.27; P16-12 -3.81,1.27; P16-13 -3.81,3.81; P16-14 -3.81,6.35; P16-15 -3.81,8.89; P16-16 -3.81,11.43; P16-17 -3.81,13.97; P16-18 -3.81,16.51; P16-19 -3.81,19.05; P16-20 -3.81,21.59; P16-21 -3.81,24.13; P16-22 -3.81,26.67; P17-01 -1.27,-26.67; P17-02 -1.27,-24.13; P17-03 -1.27,-21.59; P17-04 -1.27,-19.05; P17-05 -1.27,-16.51; P17-06 -1.27,-13.97; P17-07 -1.27,-11.43; P17-08 -1.27,-8.89; P17-09 -1.27,-6.35; P17-10 -1.27,-3.81; P17-11 -1.27,-1.27; P17-12 -1.27,1.27; P17-13 -1.27,3.81; P17-14 -1.27,6.35; P17-15 -1.27,8.89; P17-16 -1.27,11.43; P17-17 -1.27,13.97; P17-18 -1.27,16.51; P17-19 -1.27,19.05; P17-20 -1.27,21.59; P17-21 -1.27,24.13; P17-22 -1.27,26.67; P18-01 1.27,-26.67; P18-02 1.27,-24.13; P18-03 1.27,-21.59; P18-04 1.27,-19.05; P18-05 1.27,-16.51; P18-06 1.27,-13.97; P18-07 1.27,-11.43; P18-08 1.27,-8.89; P18-09 1.27,-6.35; P18-10 1.27,-3.81; P18-11 1.27,-1.27; P18-12 1.27,1.27; P18-13 1.27,3.81; P18-14 1.27,6.35; P18-15 1.27,8.89; P18-16 1.27,11.43; P18-17 1.27,13.97; P18-18 1.27,16.51; P18-19 1.27,19.05; P18-20 1.27,21.59; P18-21 1.27,24.13; P18-22 1.27,26.67; P19-01 3.81,-26.67; P19-02 3.81,-24.13; P19-03 3.81,-21.59; P19-04 3.81,-19.05; P19-05 3.81,-16.51; P19-06 3.81,-13.97; P19-07 3.81,-11.43; P19-08 3.81,-8.89; P19-09 3.81,-6.35; P19-10 3.81,-3.81; P19-11 3.81,-1.27; P19-12 3.81,1.27; P19-13 3.81,3.81; P19-14 3.81,6.35; P19-15 3.81,8.89; P19-16 3.81,11.43; P19-17 3.81,13.97; P19-18 3.81,16.51; P19-19 3.81,19.05; P19-20 3.81,21.59; P19-21 3.81,24.13; P19-22 3.81,26.67; P20-01 6.35,-26.67; P20-02 6.35,-24.13; P20-03 6.35,-21.59; P20-04 6.35,-19.05; P20-05 6.35,-16.51; P20-06 6.35,-13.97; P20-07 6.35,-11.43; P20-08 6.35,-8.89; P20-09 6.35,-6.35; P20-10 6.35,-3.81; P20-11 6.35,-1.27; P20-12 6.35,1.27; P20-13 6.35,3.81; P20-14 6.35,6.35; P20-15 6.35,8.89; P20-16 6.35,11.43; P20-17 6.35,13.97; P20-18 6.35,16.51; P20-19 6.35,19.05; P20-20 6.35,21.59; P20-21 6.35,24.13; P20-22 6.35,26.67; P21-01 8.89,-26.67; P21-02 8.89,-24.13; P21-03 8.89,-21.59; P21-04 8.89,-19.05; P21-05 8.89,-16.51; P21-06 8.89,-13.97; P21-07 8.89,-11.43; P21-08 8.89,-8.89; P21-09 8.89,-6.35; P21-10 8.89,-3.81; P21-11 8.89,-1.27; P21-12 8.89,1.27; P21-13 8.89,3.81; P21-14 8.89,6.35; P21-15 8.89,8.89; P21-16 8.89,11.43; P21-17 8.89,13.97; P21-18 8.89,16.51; P21-19 8.89,19.05; P21-20 8.89,21.59; P21-21 8.89,24.13; P21-22 8.89,26.67; P22-01 11.43,-26.67; P22-02 11.43,-24.13; P22-03 11.43,-21.59; P22-04 11.43,-19.05; P22-05 11.43,-16.51; P22-06 11.43,-13.97; P22-07 11.43,-11.43; P22-08 11.43,-8.89; P22-09 11.43,-6.35; P22-10 11.43,-3.81; P22-11 11.43,-1.27; P22-12 11.43,1.27; P22-13 11.43,3.81; P22-14 11.43,6.35; P22-15 11.43,8.89; P22-16 11.43,11.43; P22-17 11.43,13.97; P22-18 11.43,16.51; P22-19 11.43,19.05; P22-20 11.43,21.59; P22-21 11.43,24.13; P22-22 11.43,26.67; P23-01 13.97,-26.67; P23-02 13.97,-24.13; P23-03 13.97,-21.59; P23-04 13.97,-19.05; P23-05 13.97,-16.51; P23-06 13.97,-13.97; P23-07 13.97,-11.43; P23-08 13.97,-8.89; P23-09 13.97,-6.35; P23-10 13.97,-3.81; P23-11 13.97,-1.27; P23-12 13.97,1.27; P23-13 13.97,3.81; P23-14 13.97,6.35; P23-15 13.97,8.89; P23-16 13.97,11.43; P23-17 13.97,13.97; P23-18 13.97,16.51; P23-19 13.97,19.05; P23-20 13.97,21.59; P23-21 13.97,24.13; P23-22 13.97,26.67; P24-01 16.51,-26.67; P24-02 16.51,-24.13; P24-03 16.51,-21.59; P24-04 16.51,-19.05; P24-05 16.51,-16.51; P24-06 16.51,-13.97; P24-07 16.51,-11.43; P24-08 16.51,-8.89; P24-09 16.51,-6.35; P24-10 16.51,-3.81; P24-11 16.51,-1.27; P24-12 16.51,1.27; P24-13 16.51,3.81; P24-14 16.51,6.35; P24-15 16.51,8.89; P24-16 16.51,11.43; P24-17 16.51,13.97; P24-18 16.51,16.51; P24-19 16.51,19.05; P24-20 16.51,21.59; P24-21 16.51,24.13; P24-22 16.51,26.67; P25-01 19.05,-26.67; P25-02 19.05,-24.13; P25-03 19.05,-21.59; P25-04 19.05,-19.05; P25-05 19.05,-16.51; P25-06 19.05,-13.97; P25-07 19.05,-11.43; P25-08 19.05,-8.89; P25-09 19.05,-6.35; P25-10 19.05,-3.81; P25-11 19.05,-1.27; P25-12 19.05,1.27; P25-13 19.05,3.81; P25-14 19.05,6.35; P25-15 19.05,8.89; P25-16 19.05,11.43; P25-17 19.05,13.97; P25-18 19.05,16.51; P25-19 19.05,19.05; P25-20 19.05,21.59; P25-21 19.05,24.13; P25-22 19.05,26.67; P26-01 21.59,-26.67; P26-04 21.59,-19.05; P26-05 21.59,-16.51; P26-06 21.59,-13.97; P26-07 21.59,-11.43; P26-08 21.59,-8.89; P26-09 21.59,-6.35; P26-10 21.59,-3.81; P26-11 21.59,-1.27; P26-12 21.59,1.27; P26-13 21.59,3.81; P26-14 21.59,6.35; P26-15 21.59,8.89; P26-16 21.59,11.43; P26-17 21.59,13.97; P26-18 21.59,16.51; P26-19 21.59,19.05; P26-22 21.59,26.67; P27-01 24.13,-26.67; P27-04 24.13,-19.05; P27-05 24.13,-16.51; P27-06 24.13,-13.97; P27-07 24.13,-11.43; P27-08 24.13,-8.89; P27-09 24.13,-6.35; P27-10 24.13,-3.81; P27-11 24.13,-1.27; P27-12 24.13,1.27; P27-13 24.13,3.81; P27-14 24.13,6.35; P27-15 24.13,8.89; P27-16 24.13,11.43; P27-17 24.13,13.97; P27-18 24.13,16.51; P27-22 24.13,26.67; P28-03 26.67,-21.59; P28-04 26.67,-19.05; P28-05 26.67,-16.51; P28-06 26.67,-13.97; P28-07 26.67,-11.43; P28-08 26.67,-8.89; P28-09 26.67,-6.35; P28-12 26.67,1.27; P28-13 26.67,3.81; P28-14 26.67,6.35; P28-15 26.67,8.89; P28-16 26.67,11.43; P28-17 26.67,13.97; P28-18 26.67,16.51; P28-19 27.94,19.05; P28-20 26.67,21.59; P28-21 26.67,24.13; P28-22 26.67,26.67; P29-03 29.21,-21.59; P29-04 29.21,-19.05; P29-05 29.21,-16.51; P29-06 29.21,-13.97; P29-07 29.21,-11.43; P29-08 29.21,-8.89; P29-09 29.21,-6.35; P29-12 29.21,1.27; P29-13 29.21,3.81; P29-14 29.21,6.35; P29-15 29.21,8.89; P29-16 29.21,11.43; P29-17 29.21,13.97; P29-18 29.21,16.51; P29-20 29.21,21.59; P29-21 29.21,24.13; P29-22 29.21,26.67; P30-03 31.75,-21.59; P30-04 31.75,-19.05; P30-05 31.75,-16.51; P30-06 31.75,-13.97; P30-07 31.75,-11.43; P30-08 31.75,-8.89; P30-09 31.75,-6.35; P30-12 31.75,1.27; P30-13 31.75,3.81; P30-14 31.75,6.35; P30-15 31.75,8.89; P30-17 31.75,13.97; P30-18 31.75,16.51; P30-19 31.75,19.05; P30-20 31.75,21.59; P30-21 31.75,24.13; P30-22 31.75,26.67; P31-01 34.29,-26.67; P31-02 34.29,-24.13; P31-05 34.29,-16.51; P31-06 34.29,-13.97; P31-07 34.29,-11.43; P31-08 34.29,-8.89; P31-09 34.29,-6.35; P31-10 34.29,-3.81; P31-11 34.29,-1.27; P31-12 34.29,1.27; P31-13 34.29,3.81; P31-14 34.29,6.35; P31-15 34.29,8.89; P31-17 34.29,13.97; P31-18 34.29,16.51; P31-21 34.29,24.13; P31-22 34.29,26.67; P32-05 36.83,-16.51; P32-09 36.83,-6.35; P32-10 36.83,-3.81; P32-11 36.83,-1.27; P32-12 36.83,1.27; P32-13 36.83,3.81; P32-14 36.83,6.35; P32-18 36.83,16.51; P33-05 39.37,-16.51; P33-10 39.37,-3.81; P33-13 39.37,3.81; P33-14 39.37,6.35; P33-15 39.37,8.89; P33-17 39.37,13.97; P34-13 41.91,3.81; P34-14 41.91,6.35; P34-15 41.91,8.89; P34-16 41.91,11.43; P34-17 41.91,13.97 | drill 2: P03-16 -36.005,11.43; P32-16 36.005,11.43 | smd 1.27 x 1.27 bottom: VCC -41.746,16.51; VIN -39.534,16.51

### Placement (x,y rotation side)
J2  86.91,18.84 180 top
P1  45,29 0 top

### Tracks (layer width: path | path; a pad name or v marks a point on that pad's centre or on a via)
GND
  Top 0.152: 86.62,22.65 J2.SHIELD@2
  Top 0.406: J2.GND 86.62,22.65
  pour Top (isolate 1.016): -1.48,59.48 -1.48,-1.48 91.61,-1.48 91.61,59.48
N$2
  Bottom 0.152: P1.P02-17 5.55,43.05
  Bottom 0.406: P1.P06-19 P1.P05-19 11.98,46.78 6.74,46.78 5.55,45.59
  Bottom 0.61: 5.55,45.59 P1.VIN
  Bottom 0.813: 5.55,43.05 5.55,45.59 | P1.P03-16 P1.P02-17
N$4
  Top 0.406: P1.P28-19 P1.P30-19 78.02,46.78 83.26,46.78 P1.B-GND
  Top 0.61: 84.37,45.35 P1.B-GND
  Top 0.813: P1.P32-16 82.95,41.9 P1.P33-17 84.37,45.35
N$5
  Top 0.305: J2.ID 82.3,19.64 P1.P31-09
N$6
  Top 0.305: J2.D+ 80.56,18.84 P1.P31-08
N$7
  Top 0.305: J2.D- 79.76,18.04 P1.P31-07
N$8
  Top 0.305: J2.VBUS 81.5,17.24 P1.P31-06
VCC
  pour Bottom (isolate 1.016): -0.21,58.21 -0.21,-0.21 90.34,-0.21 90.34,58.21

### Text on the board
tPlace: + | + | digitalconcepts.net.au | 10068-PBIA v1.3 | USB